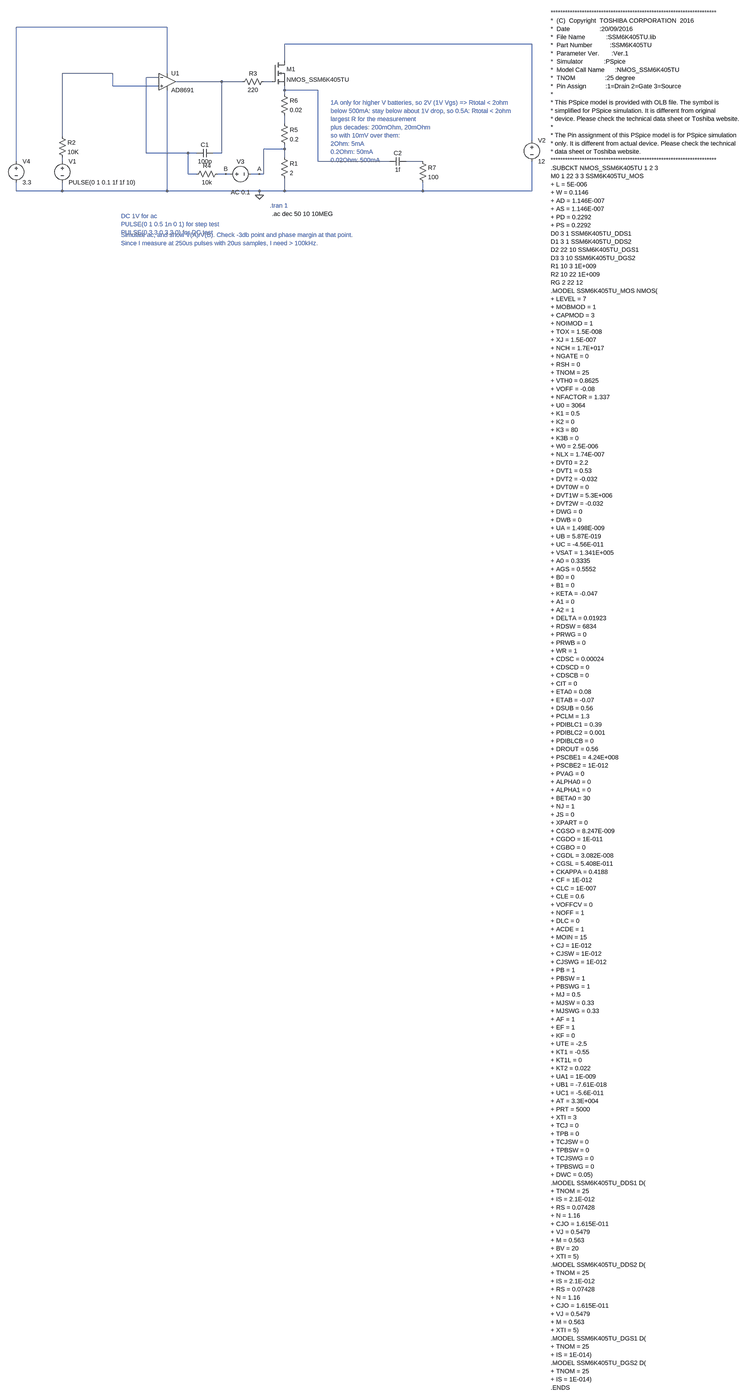
[diagram p0: schematic currentsink.asc, whole sheet]
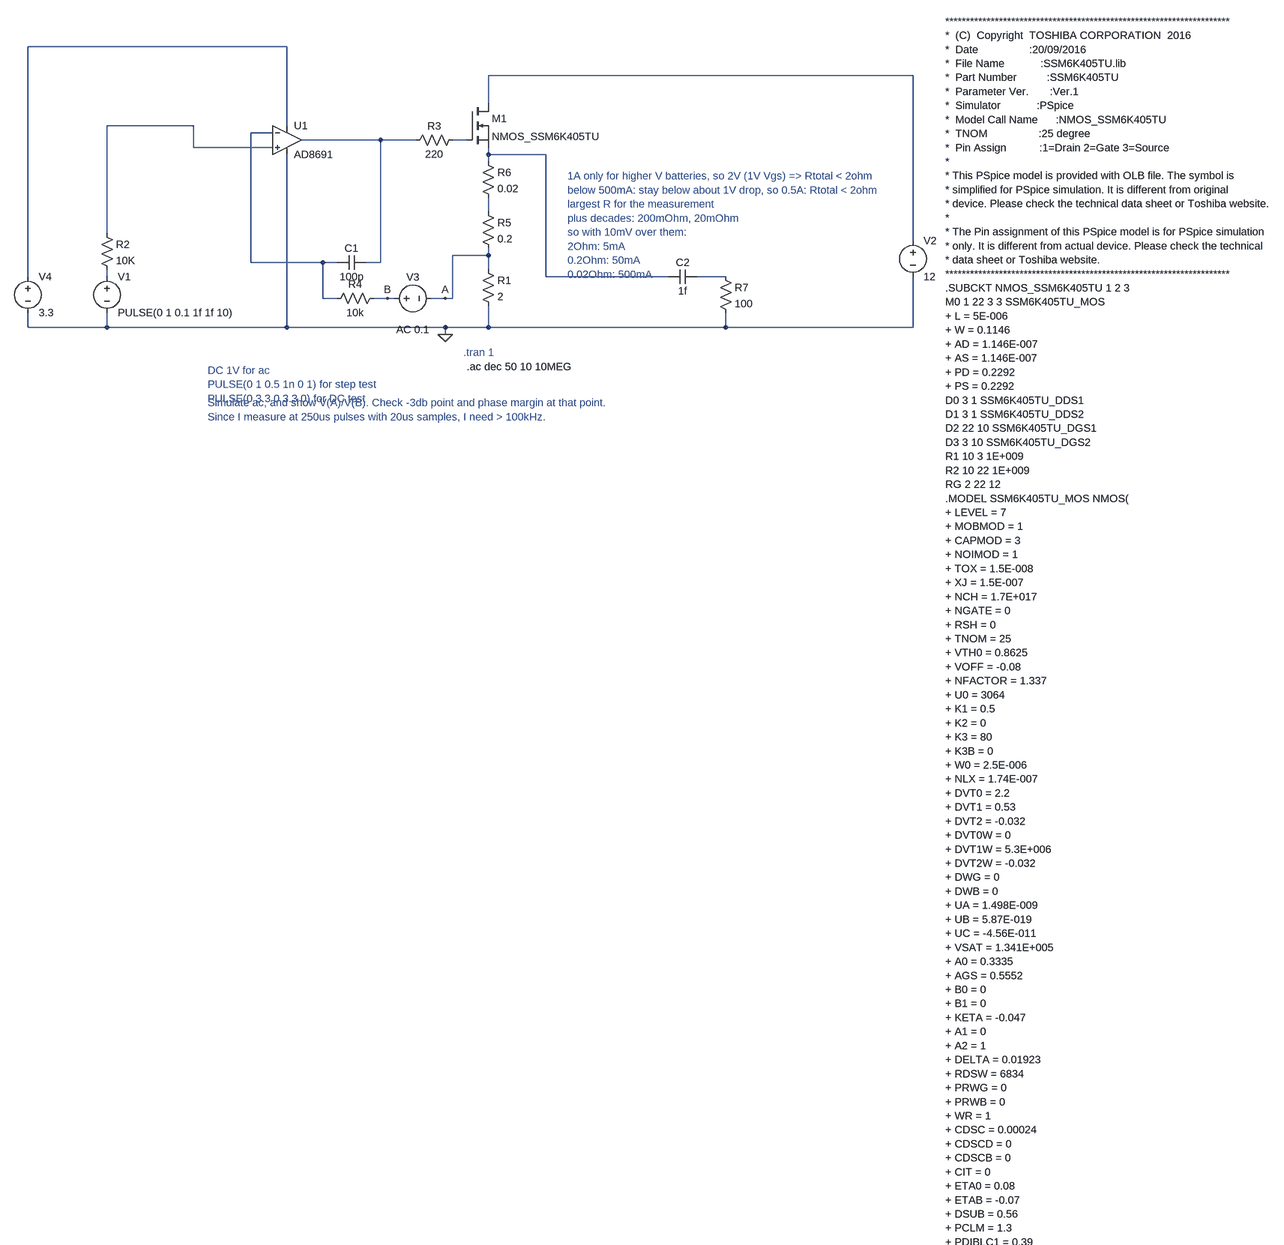
[diagram p1: schematic currentsink.asc, part, row 1 of 2, column 1 of 1]
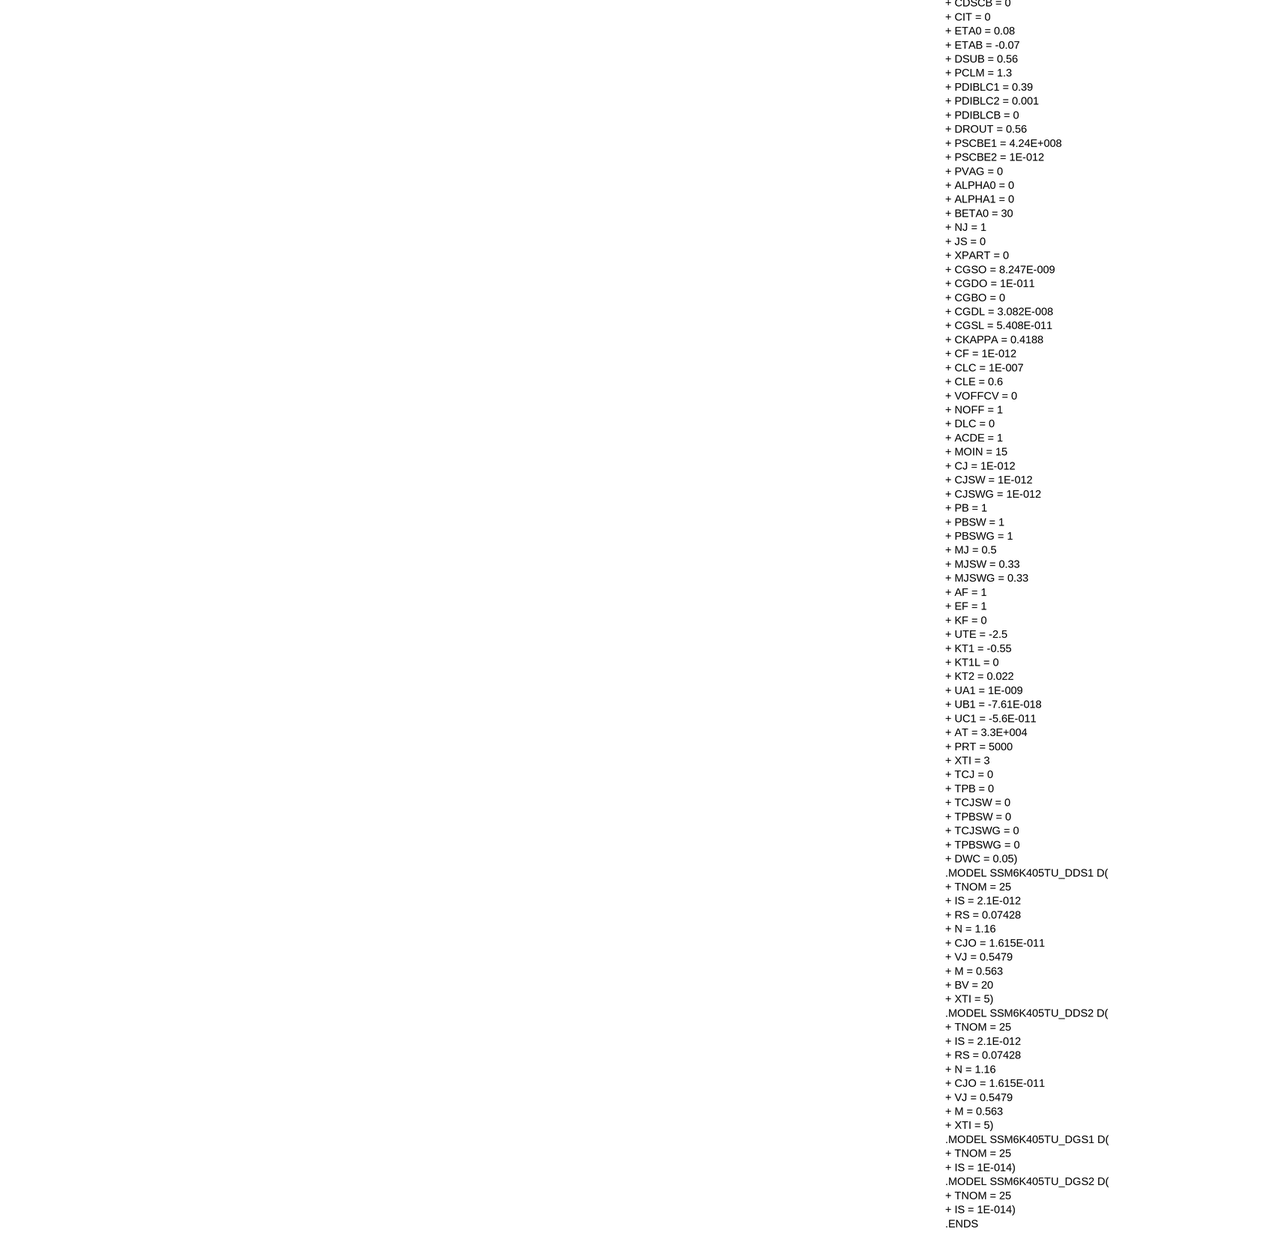
[diagram p2: schematic currentsink.asc, part, row 2 of 2, column 1 of 1]
currentsink.asc, the LTspice schematic file:
Version 4
SHEET 1 1920 3864
WIRE -320 -144 -896 -144
WIRE 1072 -80 128 -80
WIRE 128 -16 128 -80
WIRE -528 32 -720 32
WIRE -320 32 -320 -144
WIRE -352 48 -400 48
WIRE -112 64 -288 64
WIRE -32 64 -112 64
WIRE 80 64 48 64
WIRE -528 80 -528 32
WIRE -352 80 -528 80
WIRE 128 96 128 80
WIRE 256 96 128 96
WIRE 128 112 128 96
WIRE 128 224 128 192
WIRE -720 272 -720 32
WIRE 1072 288 1072 -80
WIRE 128 320 128 304
WIRE 128 320 48 320
WIRE -400 336 -400 48
WIRE -240 336 -400 336
WIRE -208 336 -240 336
WIRE -112 336 -112 64
WIRE -112 336 -144 336
WIRE 128 352 128 320
WIRE -896 368 -896 -144
WIRE -720 368 -720 352
WIRE 256 368 256 96
WIRE 528 368 256 368
WIRE 656 368 592 368
WIRE -240 416 -240 336
WIRE -208 416 -240 416
WIRE -96 416 -128 416
WIRE -80 416 -96 416
WIRE 32 416 0 416
WIRE 48 416 48 320
WIRE 48 416 32 416
WIRE -896 480 -896 448
WIRE -720 480 -720 448
WIRE -720 480 -896 480
WIRE -320 480 -320 96
WIRE -320 480 -720 480
WIRE 32 480 -320 480
WIRE 128 480 128 432
WIRE 128 480 32 480
WIRE 656 480 656 448
WIRE 656 480 128 480
WIRE 1072 480 1072 368
WIRE 1072 480 656 480
WIRE 32 496 32 480
FLAG 32 496 0
FLAG -96 416 B
FLAG 32 416 A
SYMBOL nmos 80 -16 R0
SYMATTR InstName M1
SYMATTR Value NMOS_SSM6K405TU
SYMATTR Prefix X
SYMBOL voltage -720 352 R0
SYMATTR InstName V1
SYMATTR Value PULSE(0 1 0.1 1f 1f 10)
SYMBOL res 112 336 R0
SYMATTR InstName R1
SYMATTR Value 2
SYMBOL res -736 256 R0
SYMATTR InstName R2
SYMATTR Value 10K
SYMBOL voltage 1072 272 R0
SYMATTR InstName V2
SYMATTR Value 12
SYMBOL res 64 48 R90
WINDOW 0 0 56 VBottom 2
WINDOW 3 32 56 VTop 2
SYMATTR InstName R3
SYMATTR Value 220
SYMBOL res -112 400 R90
WINDOW 0 0 56 VBottom 2
WINDOW 3 32 56 VTop 2
SYMATTR InstName R4
SYMATTR Value 10k
SYMBOL cap -144 320 R90
WINDOW 0 0 32 VBottom 2
WINDOW 3 32 32 VTop 2
SYMATTR InstName C1
SYMATTR Value 100p
SYMBOL voltage -96 416 R270
WINDOW 0 32 56 VTop 2
WINDOW 3 -32 56 VBottom 2
WINDOW 123 -54 56 VBottom 2
SYMATTR InstName V3
SYMATTR Value ""
SYMATTR Value2 AC 0.1
SYMBOL voltage -896 352 R0
SYMATTR InstName V4
SYMATTR Value 3.3
SYMBOL OpAmps/AD8691 -320 0 R0
SYMATTR InstName U1
SYMBOL res 112 208 R0
SYMATTR InstName R5
SYMATTR Value 0.2
SYMBOL res 112 96 R0
SYMATTR InstName R6
SYMATTR Value 0.02
SYMBOL res 640 352 R0
SYMATTR InstName R7
SYMATTR Value 100
SYMBOL cap 592 352 R90
WINDOW 0 0 32 VBottom 2
WINDOW 3 32 32 VTop 2
SYMATTR InstName C2
SYMATTR Value 1f
TEXT 1144 -200 Left 2 !*********************************************************************\n*  (C)  Copyright  TOSHIBA CORPORATION  2016\n*  Date                 :20/09/2016\n*  File Name            :SSM6K405TU.lib\n*  Part Number          :SSM6K405TU\n*  Parameter Ver.       :Ver.1\n*  Simulator            :PSpice\n*  Model Call Name      :NMOS_SSM6K405TU\n*  TNOM                 :25 degree\n*  Pin Assign           :1=Drain 2=Gate 3=Source\n*\n* This PSpice model is provided with OLB file. The symbol is\n* simplified for PSpice simulation. It is different from original\n* device. Please check the technical data sheet or Toshiba website.\n*\n* The Pin assignment of this PSpice model is for PSpice simulation\n* only. It is different from actual device. Please check the technical\n* data sheet or Toshiba website.\n*********************************************************************\n.SUBCKT NMOS_SSM6K405TU 1 2 3\nM0 1 22 3 3 SSM6K405TU_MOS\n+ L = 5E-006\n+ W = 0.1146\n+ AD = 1.146E-007\n+ AS = 1.146E-007\n+ PD = 0.2292\n+ PS = 0.2292\nD0 3 1 SSM6K405TU_DDS1\nD1 3 1 SSM6K405TU_DDS2\nD2 22 10 SSM6K405TU_DGS1\nD3 3 10 SSM6K405TU_DGS2\nR1 10 3 1E+009\nR2 10 22 1E+009\nRG 2 22 12\n.MODEL SSM6K405TU_MOS NMOS(\n+ LEVEL = 7\n+ MOBMOD = 1\n+ CAPMOD = 3\n+ NOIMOD = 1\n+ TOX = 1.5E-008\n+ XJ = 1.5E-007\n+ NCH = 1.7E+017\n+ NGATE = 0\n+ RSH = 0\n+ TNOM = 25\n+ VTH0 = 0.8625\n+ VOFF = -0.08\n+ NFACTOR = 1.337\n+ U0 = 3064\n+ K1 = 0.5\n+ K2 = 0\n+ K3 = 80\n+ K3B = 0\n+ W0 = 2.5E-006\n+ NLX = 1.74E-007\n+ DVT0 = 2.2\n+ DVT1 = 0.53\n+ DVT2 = -0.032\n+ DVT0W = 0\n+ DVT1W = 5.3E+006\n+ DVT2W = -0.032\n+ DWG = 0\n+ DWB = 0\n+ UA = 1.498E-009\n+ UB = 5.87E-019\n+ UC = -4.56E-011\n+ VSAT = 1.341E+005\n+ A0 = 0.3335\n+ AGS = 0.5552\n+ B0 = 0\n+ B1 = 0\n+ KETA = -0.047\n+ A1 = 0\n+ A2 = 1\n+ DELTA = 0.01923\n+ RDSW = 6834\n+ PRWG = 0\n+ PRWB = 0\n+ WR = 1\n+ CDSC = 0.00024\n+ CDSCD = 0\n+ CDSCB = 0\n+ CIT = 0\n+ ETA0 = 0.08\n+ ETAB = -0.07\n+ DSUB = 0.56\n+ PCLM = 1.3\n+ PDIBLC1 = 0.39\n+ PDIBLC2 = 0.001\n+ PDIBLCB = 0\n+ DROUT = 0.56\n+ PSCBE1 = 4.24E+008\n+ PSCBE2 = 1E-012\n+ PVAG = 0\n+ ALPHA0 = 0\n+ ALPHA1 = 0\n+ BETA0 = 30\n+ NJ = 1\n+ JS = 0\n+ XPART = 0\n+ CGSO = 8.247E-009\n+ CGDO = 1E-011\n+ CGBO = 0\n+ CGDL = 3.082E-008\n+ CGSL = 5.408E-011\n+ CKAPPA = 0.4188\n+ CF = 1E-012\n+ CLC = 1E-007\n+ CLE = 0.6\n+ VOFFCV = 0\n+ NOFF = 1\n+ DLC = 0\n+ ACDE = 1\n+ MOIN = 15\n+ CJ = 1E-012\n+ CJSW = 1E-012\n+ CJSWG = 1E-012\n+ PB = 1\n+ PBSW = 1\n+ PBSWG = 1\n+ MJ = 0.5\n+ MJSW = 0.33\n+ MJSWG = 0.33\n+ AF = 1\n+ EF = 1\n+ KF = 0\n+ UTE = -2.5\n+ KT1 = -0.55\n+ KT1L = 0\n+ KT2 = 0.022\n+ UA1 = 1E-009\n+ UB1 = -7.61E-018\n+ UC1 = -5.6E-011\n+ AT = 3.3E+004\n+ PRT = 5000\n+ XTI = 3\n+ TCJ = 0\n+ TPB = 0\n+ TCJSW = 0\n+ TPBSW = 0\n+ TCJSWG = 0\n+ TPBSWG = 0\n+ DWC = 0.05)\n.MODEL SSM6K405TU_DDS1 D(\n+ TNOM = 25\n+ IS = 2.1E-012\n+ RS = 0.07428\n+ N = 1.16\n+ CJO = 1.615E-011\n+ VJ = 0.5479\n+ M = 0.563\n+ BV = 20\n+ XTI = 5)\n.MODEL SSM6K405TU_DDS2 D(\n+ TNOM = 25\n+ IS = 2.1E-012\n+ RS = 0.07428\n+ N = 1.16\n+ CJO = 1.615E-011\n+ VJ = 0.5479\n+ M = 0.563\n+ XTI = 5)\n.MODEL SSM6K405TU_DGS1 D(\n+ TNOM = 25\n+ IS = 1E-014)\n.MODEL SSM6K405TU_DGS2 D(\n+ TNOM = 25\n+ IS = 1E-014)\n.ENDS
TEXT 72 536 Left 2 ;.tran 1
TEXT 80 568 Left 2 !.ac dec 50 10 10MEG
TEXT -496 576 Left 2 ;DC 1V for ac\nPULSE(0 1 0.5 1n 0 1) for step test\nPULSE(0 3.3 0 3.3 0) for DC test
TEXT -496 648 Left 2 ;Simulate ac, and show V(A)/V(B). Check -3db point and phase margin at that point.\nSince I measure at 250us pulses with 20us samples, I need > 100kHz.
TEXT 304 144 Left 2 ;1A only for higher V batteries, so 2V (1V Vgs) => Rtotal < 2ohm\nbelow 500mA: stay below about 1V drop, so 0.5A: Rtotal < 2ohm\nlargest R for the measurement\nplus decades: 200mOhm, 20mOhm\nso with 10mV over them: \n2Ohm: 5mA\n0.2Ohm: 50mA\n0.02Ohm: 500mA

The netlist it stands for:
* currentsink.asc
XM1 N002 N006 N007 NMOS_SSM6K405TU  ; pins D G S
V1 N009 0 PULSE(0 1 0.1 1f 1f 10)
R1 A 0 2
R2 N003 N009 10K
V2 N002 0 12
R3 N006 N005 220
R4 B N004 10k
C1 N005 N004 100p
V3 B A AC 0.1
V4 N001 0 3.3
XU1 N003 N004 N001 0 N005 AD8691  ; pins In+ In- V+ V- OUT
R5 N008 A 0.2
R6 N007 N008 0.02
R7 N010 0 100
C2 N010 N007 1f
*********************************************************************
*  (C)  Copyright  TOSHIBA CORPORATION  2016
*  Date                 :20/09/2016
*  File Name            :SSM6K405TU.lib
*  Part Number          :SSM6K405TU
*  Parameter Ver.       :Ver.1
*  Simulator            :PSpice
*  Model Call Name      :NMOS_SSM6K405TU
*  TNOM                 :25 degree
*  Pin Assign           :1=Drain 2=Gate 3=Source
*
* This PSpice model is provided with OLB file. The symbol is
* simplified for PSpice simulation. It is different from original
* device. Please check the technical data sheet or Toshiba website.
*
* The Pin assignment of this PSpice model is for PSpice simulation
* only. It is different from actual device. Please check the technical
* data sheet or Toshiba website.
*********************************************************************
.SUBCKT NMOS_SSM6K405TU 1 2 3
M0 1 22 3 3 SSM6K405TU_MOS
+ L = 5E-006
+ W = 0.1146
+ AD = 1.146E-007
+ AS = 1.146E-007
+ PD = 0.2292
+ PS = 0.2292
D0 3 1 SSM6K405TU_DDS1
D1 3 1 SSM6K405TU_DDS2
D2 22 10 SSM6K405TU_DGS1
D3 3 10 SSM6K405TU_DGS2
R1 10 3 1E+009
R2 10 22 1E+009
RG 2 22 12
.MODEL SSM6K405TU_MOS NMOS(
+ LEVEL = 7
+ MOBMOD = 1
+ CAPMOD = 3
+ NOIMOD = 1
+ TOX = 1.5E-008
+ XJ = 1.5E-007
+ NCH = 1.7E+017
+ NGATE = 0
+ RSH = 0
+ TNOM = 25
+ VTH0 = 0.8625
+ VOFF = -0.08
+ NFACTOR = 1.337
+ U0 = 3064
+ K1 = 0.5
+ K2 = 0
+ K3 = 80
+ K3B = 0
+ W0 = 2.5E-006
+ NLX = 1.74E-007
+ DVT0 = 2.2
+ DVT1 = 0.53
+ DVT2 = -0.032
+ DVT0W = 0
+ DVT1W = 5.3E+006
+ DVT2W = -0.032
+ DWG = 0
+ DWB = 0
+ UA = 1.498E-009
+ UB = 5.87E-019
+ UC = -4.56E-011
+ VSAT = 1.341E+005
+ A0 = 0.3335
+ AGS = 0.5552
+ B0 = 0
+ B1 = 0
+ KETA = -0.047
+ A1 = 0
+ A2 = 1
+ DELTA = 0.01923
+ RDSW = 6834
+ PRWG = 0
+ PRWB = 0
+ WR = 1
+ CDSC = 0.00024
+ CDSCD = 0
+ CDSCB = 0
+ CIT = 0
+ ETA0 = 0.08
+ ETAB = -0.07
+ DSUB = 0.56
+ PCLM = 1.3
+ PDIBLC1 = 0.39
+ PDIBLC2 = 0.001
+ PDIBLCB = 0
+ DROUT = 0.56
+ PSCBE1 = 4.24E+008
+ PSCBE2 = 1E-012
+ PVAG = 0
+ ALPHA0 = 0
+ ALPHA1 = 0
+ BETA0 = 30
+ NJ = 1
+ JS = 0
+ XPART = 0
+ CGSO = 8.247E-009
+ CGDO = 1E-011
+ CGBO = 0
+ CGDL = 3.082E-008
+ CGSL = 5.408E-011
+ CKAPPA = 0.4188
+ CF = 1E-012
+ CLC = 1E-007
+ CLE = 0.6
+ VOFFCV = 0
+ NOFF = 1
+ DLC = 0
+ ACDE = 1
+ MOIN = 15
+ CJ = 1E-012
+ CJSW = 1E-012
+ CJSWG = 1E-012
+ PB = 1
+ PBSW = 1
+ PBSWG = 1
+ MJ = 0.5
+ MJSW = 0.33
+ MJSWG = 0.33
+ AF = 1
+ EF = 1
+ KF = 0
+ UTE = -2.5
+ KT1 = -0.55
+ KT1L = 0
+ KT2 = 0.022
+ UA1 = 1E-009
+ UB1 = -7.61E-018
+ UC1 = -5.6E-011
+ AT = 3.3E+004
+ PRT = 5000
+ XTI = 3
+ TCJ = 0
+ TPB = 0
+ TCJSW = 0
+ TPBSW = 0
+ TCJSWG = 0
+ TPBSWG = 0
+ DWC = 0.05)
.MODEL SSM6K405TU_DDS1 D(
+ TNOM = 25
+ IS = 2.1E-012
+ RS = 0.07428
+ N = 1.16
+ CJO = 1.615E-011
+ VJ = 0.5479
+ M = 0.563
+ BV = 20
+ XTI = 5)
.MODEL SSM6K405TU_DDS2 D(
+ TNOM = 25
+ IS = 2.1E-012
+ RS = 0.07428
+ N = 1.16
+ CJO = 1.615E-011
+ VJ = 0.5479
+ M = 0.563
+ XTI = 5)
.MODEL SSM6K405TU_DGS1 D(
+ TNOM = 25
+ IS = 1E-014)
.MODEL SSM6K405TU_DGS2 D(
+ TNOM = 25
+ IS = 1E-014)
.ENDS
* .tran 1
.ac dec 50 10 10MEG
* DC 1V for ac
* PULSE(0 1 0.5 1n 0 1) for step test
* PULSE(0 3.3 0 3.3 0) for DC test
* Simulate ac, and show V(A)/V(B). Check -3db point and phase margin at that point.
* Since I measure at 250us pulses with 20us samples, I need > 100kHz.
* 1A only for higher V batteries, so 2V (1V Vgs) => Rtotal < 2ohm
* below 500mA: stay below about 1V drop, so 0.5A: Rtotal < 2ohm
* largest R for the measurement
* plus decades: 200mOhm, 20mOhm
* so with 10mV over them:
* 2Ohm: 5mA
* 0.2Ohm: 50mA
* 0.02Ohm: 500mA
.backanno
.end